# Altium schematic sheet Main_Connector.SchDoc
size A; SheetNumber: 1; SheetTotal: 6
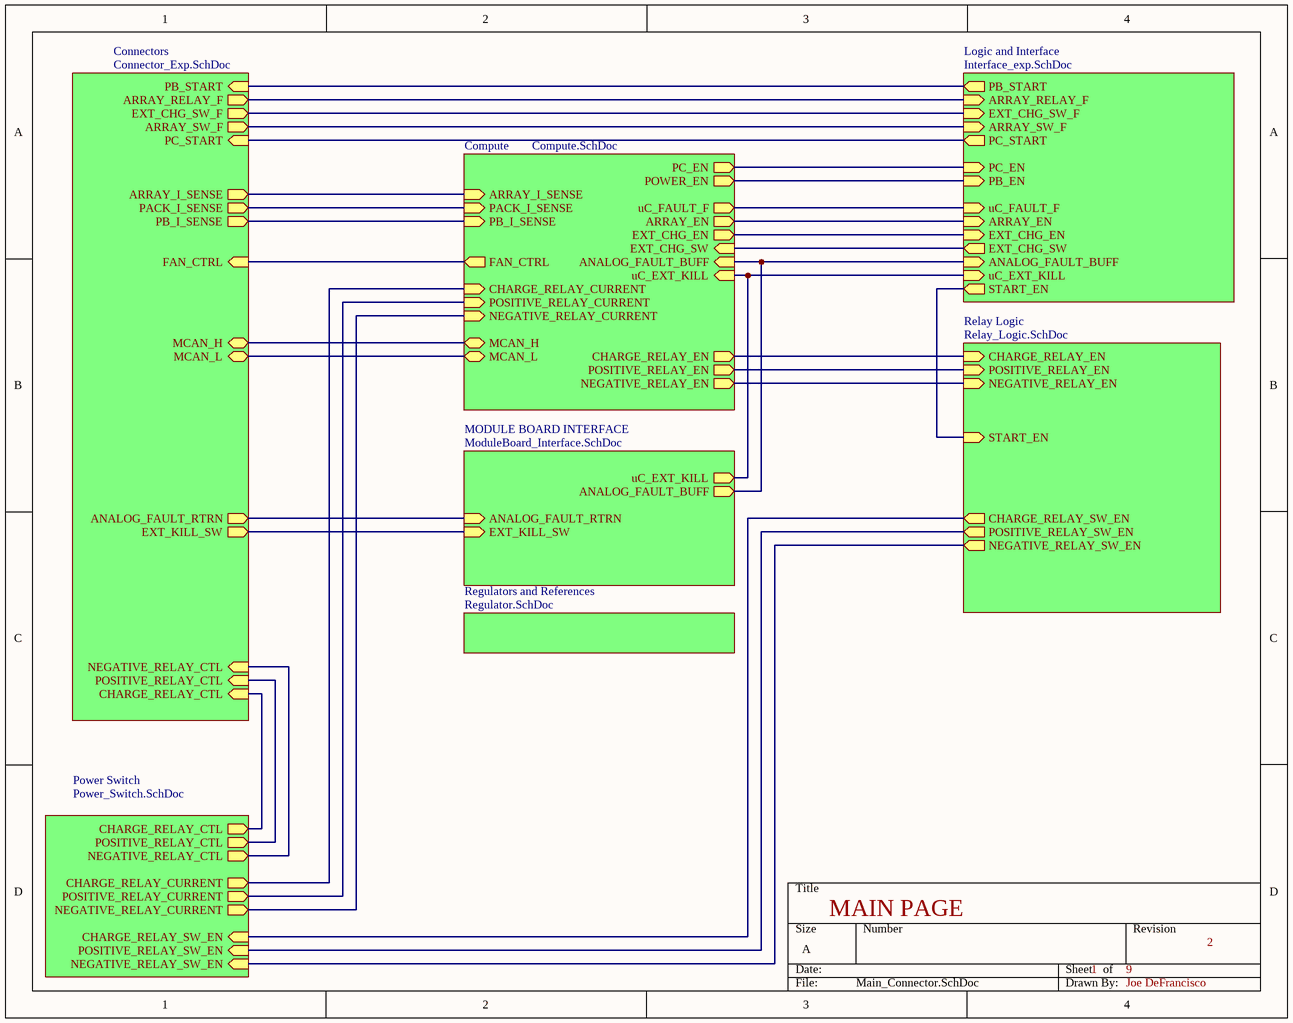
[diagram p0: Main_Connector.SchDoc]

## Sub-sheets
Compute = Compute.SchDoc: ARRAY_I_SENSE (in), PACK_I_SENSE (in), PB_I_SENSE (in), FAN_CTRL (out), MCAN_H (bidir), MCAN_L (bidir), uC_EXT_KILL (in), EXT_CHG_SW (in), EXT_CHG_EN (out), uC_FAULT_F (out), ARRAY_EN (out), ANALOG_FAULT_BUFF (in), CHARGE_RELAY_EN (out), POSITIVE_RELAY_EN (out), NEGATIVE_RELAY_EN (out), PC_EN (out), POWER_EN (out), NEGATIVE_RELAY_CURRENT (in), POSITIVE_RELAY_CURRENT (in), CHARGE_RELAY_CURRENT (in)
Connectors = Connector_Exp.SchDoc: ARRAY_I_SENSE (out), PACK_I_SENSE (out), ARRAY_SW_F (out), EXT_CHG_SW_F (out), ARRAY_RELAY_F (out), PC_START (in), PB_I_SENSE (out), EXT_KILL_SW (out), ANALOG_FAULT_RTRN (out), MCAN_H (bidir), MCAN_L (bidir), FAN_CTRL (in), CHARGE_RELAY_CTL (in), POSITIVE_RELAY_CTL (in), NEGATIVE_RELAY_CTL (in), PB_START (in)
Logic and Interface = Interface_exp.SchDoc: PC_START (out), ARRAY_SW_F (in), EXT_CHG_SW_F (in), ARRAY_RELAY_F (in), uC_FAULT_F (in), ARRAY_EN (in), EXT_CHG_EN (in), EXT_CHG_SW (out), PC_EN (in), PB_EN (in), PB_START (out), uC_EXT_KILL (in), ANALOG_FAULT_BUFF (in), START_EN (out)
MODULE BOARD INTERFACE = ModuleBoard_Interface.SchDoc: ANALOG_FAULT_RTRN (in), ANALOG_FAULT_BUFF (out), uC_EXT_KILL (out), EXT_KILL_SW (in)
Power Switch = Power_Switch.SchDoc: CHARGE_RELAY_CTL (out), POSITIVE_RELAY_CTL (out), NEGATIVE_RELAY_CTL (out), CHARGE_RELAY_SW_EN (in), POSITIVE_RELAY_SW_EN (in), NEGATIVE_RELAY_SW_EN (in), CHARGE_RELAY_CURRENT (out), POSITIVE_RELAY_CURRENT (out), NEGATIVE_RELAY_CURRENT (out)
Regulators and References = Regulator.SchDoc: no entries
Relay Logic = Relay_Logic.SchDoc: CHARGE_RELAY_EN (in), POSITIVE_RELAY_EN (in), NEGATIVE_RELAY_EN (in), CHARGE_RELAY_SW_EN (out), POSITIVE_RELAY_SW_EN (out), NEGATIVE_RELAY_SW_EN (out), START_EN (in)

## Nets
(unnamed): sheet Compute/ARRAY_I_SENSE, sheet Connectors/ARRAY_I_SENSE
(unnamed): sheet Compute/PACK_I_SENSE, sheet Connectors/PACK_I_SENSE
(unnamed): sheet Compute/PB_I_SENSE, sheet Connectors/PB_I_SENSE
(unnamed): sheet Compute/FAN_CTRL, sheet Connectors/FAN_CTRL
(unnamed): sheet Compute/MCAN_H, sheet Connectors/MCAN_H
(unnamed): sheet Compute/MCAN_L, sheet Connectors/MCAN_L
(unnamed): sheet Compute/uC_EXT_KILL, sheet Logic and Interface/uC_EXT_KILL, sheet MODULE BOARD INTERFACE/uC_EXT_KILL
(unnamed): sheet Compute/EXT_CHG_SW, sheet Logic and Interface/EXT_CHG_SW
(unnamed): sheet Compute/EXT_CHG_EN, sheet Logic and Interface/EXT_CHG_EN
(unnamed): sheet Compute/uC_FAULT_F, sheet Logic and Interface/uC_FAULT_F
(unnamed): sheet Compute/ARRAY_EN, sheet Logic and Interface/ARRAY_EN
(unnamed): sheet Compute/ANALOG_FAULT_BUFF, sheet Logic and Interface/ANALOG_FAULT_BUFF, sheet MODULE BOARD INTERFACE/ANALOG_FAULT_BUFF
(unnamed): sheet Compute/CHARGE_RELAY_EN, sheet Relay Logic/CHARGE_RELAY_EN
(unnamed): sheet Compute/POSITIVE_RELAY_EN, sheet Relay Logic/POSITIVE_RELAY_EN
(unnamed): sheet Compute/NEGATIVE_RELAY_EN, sheet Relay Logic/NEGATIVE_RELAY_EN
(unnamed): sheet Compute/PC_EN, sheet Logic and Interface/PC_EN
(unnamed): sheet Compute/POWER_EN, sheet Logic and Interface/PB_EN
(unnamed): sheet Compute/NEGATIVE_RELAY_CURRENT, sheet Power Switch/NEGATIVE_RELAY_CURRENT
(unnamed): sheet Compute/POSITIVE_RELAY_CURRENT, sheet Power Switch/POSITIVE_RELAY_CURRENT
(unnamed): sheet Compute/CHARGE_RELAY_CURRENT, sheet Power Switch/CHARGE_RELAY_CURRENT
(unnamed): sheet Connectors/ARRAY_SW_F, sheet Logic and Interface/ARRAY_SW_F
(unnamed): sheet Connectors/EXT_CHG_SW_F, sheet Logic and Interface/EXT_CHG_SW_F
(unnamed): sheet Connectors/ARRAY_RELAY_F, sheet Logic and Interface/ARRAY_RELAY_F
(unnamed): sheet Connectors/PC_START, sheet Logic and Interface/PC_START
(unnamed): sheet Connectors/EXT_KILL_SW, sheet MODULE BOARD INTERFACE/EXT_KILL_SW
(unnamed): sheet Connectors/ANALOG_FAULT_RTRN, sheet MODULE BOARD INTERFACE/ANALOG_FAULT_RTRN
(unnamed): sheet Connectors/CHARGE_RELAY_CTL, sheet Power Switch/CHARGE_RELAY_CTL
(unnamed): sheet Connectors/POSITIVE_RELAY_CTL, sheet Power Switch/POSITIVE_RELAY_CTL
(unnamed): sheet Connectors/NEGATIVE_RELAY_CTL, sheet Power Switch/NEGATIVE_RELAY_CTL
(unnamed): sheet Connectors/PB_START, sheet Logic and Interface/PB_START
(unnamed): sheet Logic and Interface/START_EN, sheet Relay Logic/START_EN
(unnamed): sheet Power Switch/CHARGE_RELAY_SW_EN, sheet Relay Logic/CHARGE_RELAY_SW_EN
(unnamed): sheet Power Switch/POSITIVE_RELAY_SW_EN, sheet Relay Logic/POSITIVE_RELAY_SW_EN
(unnamed): sheet Power Switch/NEGATIVE_RELAY_SW_EN, sheet Relay Logic/NEGATIVE_RELAY_SW_EN

## Notes on the sheet
- MAIN PAGE
- 1
- 9
- 2
- Joe DeFrancisco